# EAGLE design chainclock (EAGLE 7.4.0)
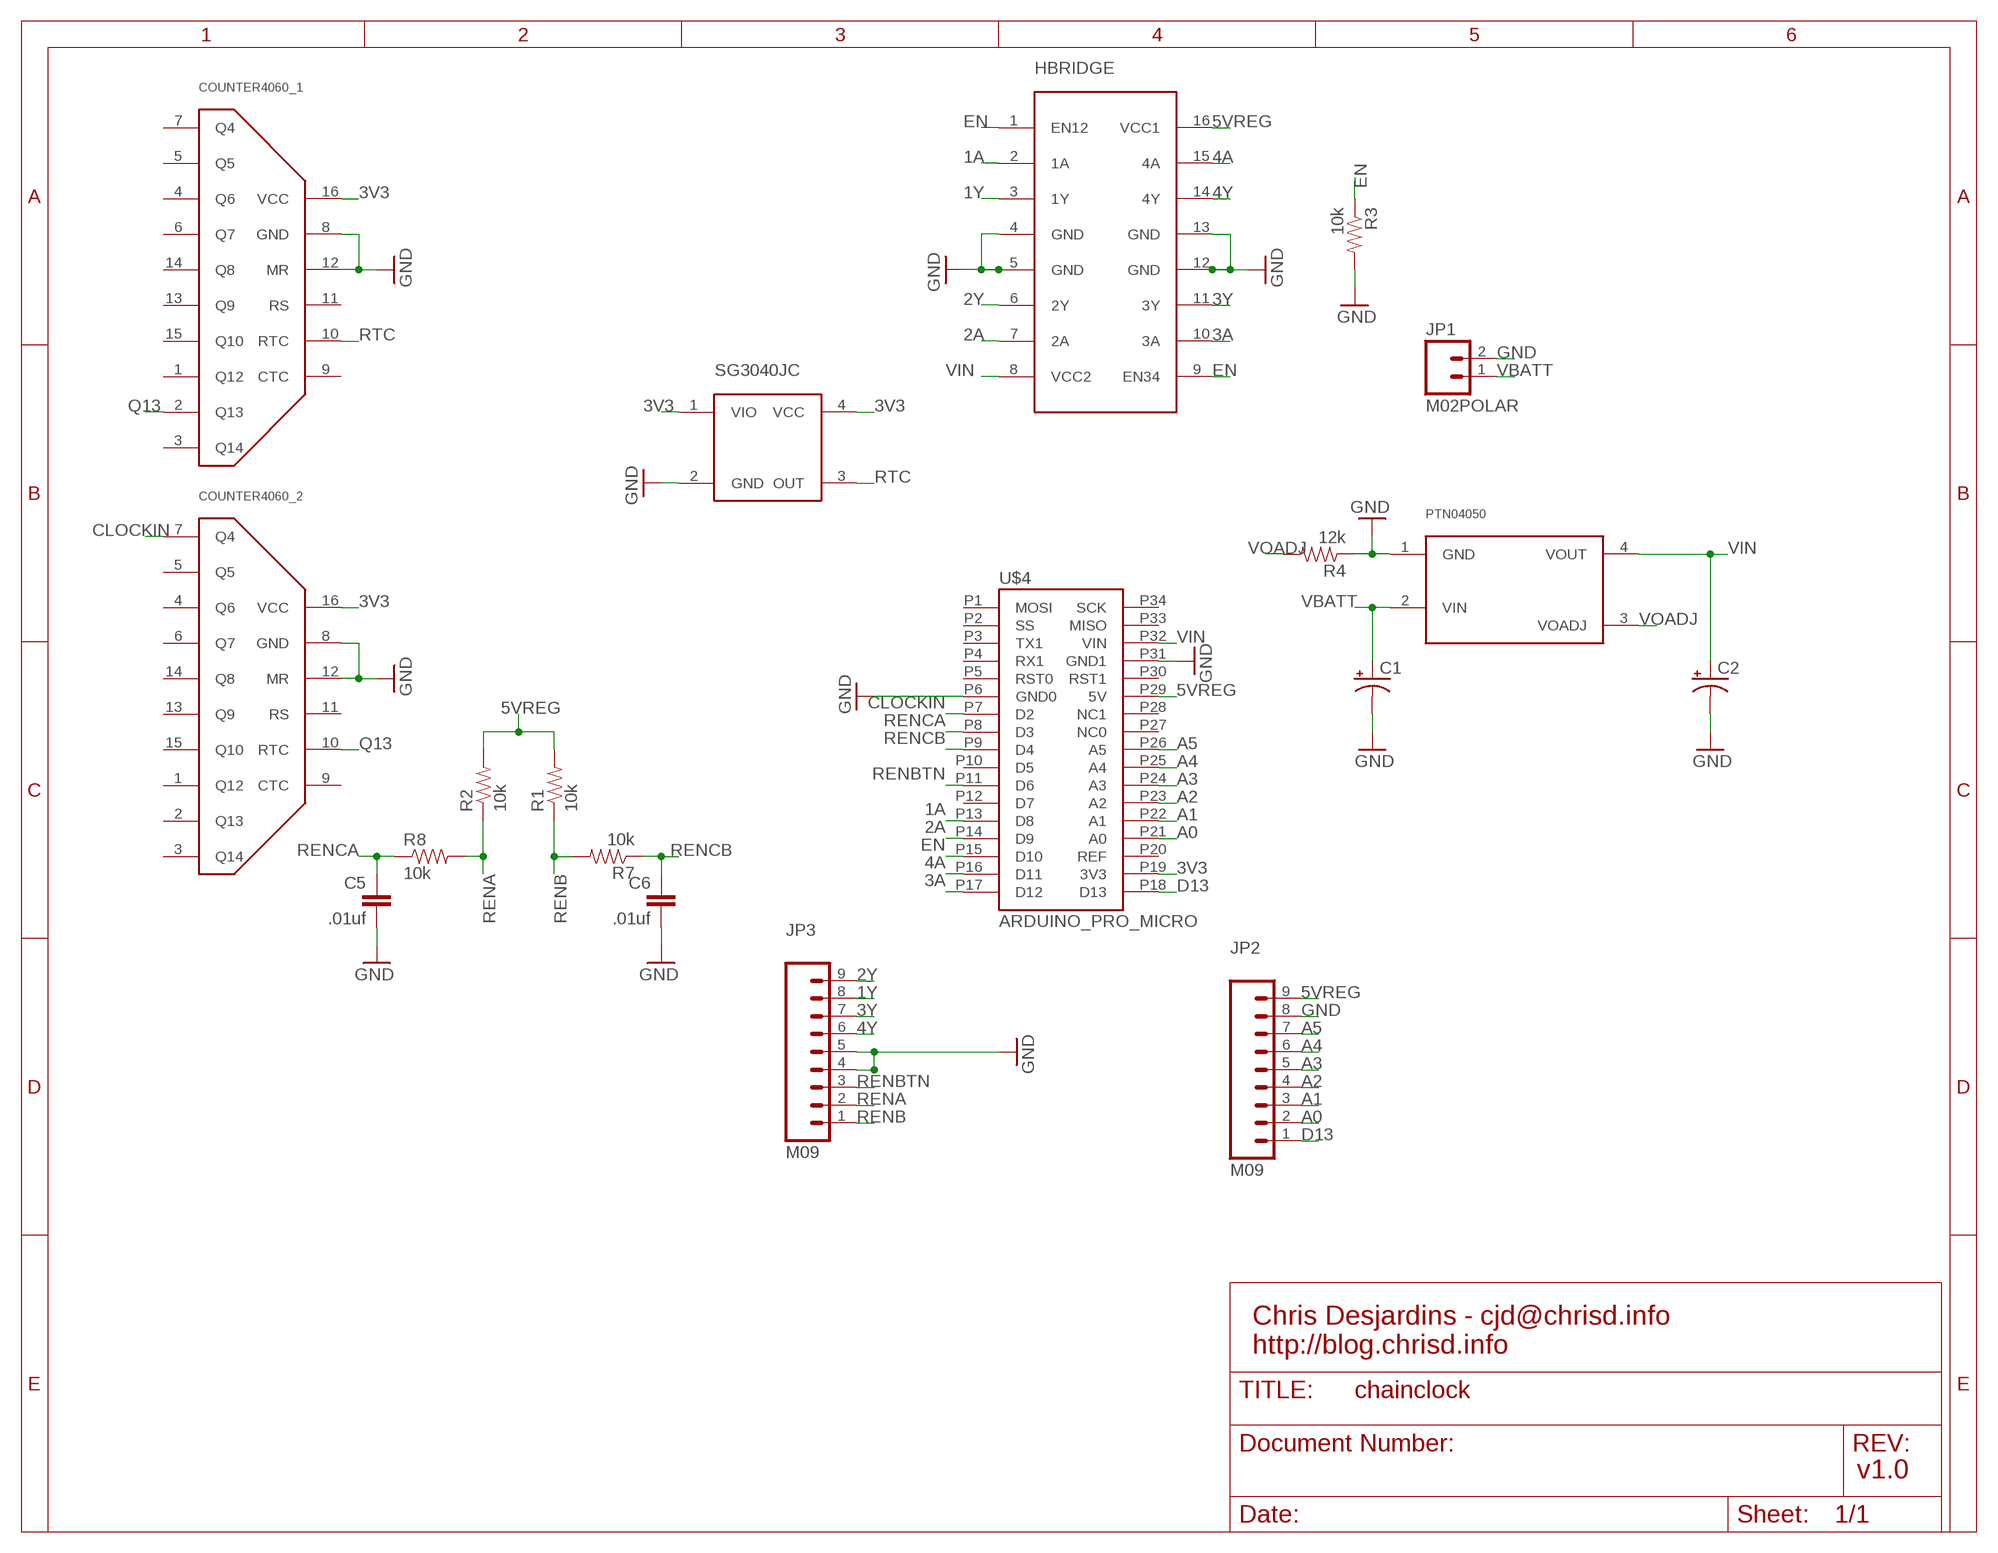
[diagram p0: schematic, sheet 1]

## Parts
C1  CAP_POLPTH1  [CPOL-RADIAL-100UF-25V]
C2  CAP_POLPTH1  [CPOL-RADIAL-100UF-25V]
C5  .01uf  CAPKIT  [CAP-PTH-SMALL-KIT]
C6  .01uf  CAPKIT  [CAP-PTH-SMALL-KIT]
COUNTER4060_1  4060SOIC16  [SO016]
COUNTER4060_2  4060SOIC16  [SO016]
HBRIDGE  SN754410  [DIL16-KIT]
JP1  M02POLAR  [MOLEX-1X2]
JP2  M09  [1X09]
JP3  M09  [1X09]
PTN04050  PTN0405C  [EUU4]
R1  10k  RESISTOREZ  [AXIAL-0.3EZ]
R2  10k  RESISTOREZ  [AXIAL-0.3EZ]
R3  10k  RESISTOREZ  [AXIAL-0.3EZ]
R4  12k  RESISTOREZ  [AXIAL-0.3EZ]
R7  10k  RESISTOREZ  [AXIAL-0.3EZ]
R8  10k  RESISTOREZ  [AXIAL-0.3EZ]
SG3040JC  SG30XXJC  [SG3030JC]
U$4  ARDUINO_PRO_MICRO  [ARDUINO_PRO_MICRO]

## Nets
1A: HBRIDGE.2(1A) U$4.P13(D8)
1Y: HBRIDGE.3(1Y) JP3.8
2A: HBRIDGE.7(2A) U$4.P14(D9)
2Y: HBRIDGE.6(2Y) JP3.9
3A: HBRIDGE.10(3A) U$4.P17(D12)
3V3: COUNTER4060_1.16(VCC) COUNTER4060_2.16(VCC) SG3040JC.1(VIO) SG3040JC.4(VCC) U$4.P19(3V3)
3Y: HBRIDGE.11(3Y) JP3.7
4A: HBRIDGE.15(4A) U$4.P16(D11)
4Y: HBRIDGE.14(4Y) JP3.6
5VREG: HBRIDGE.16(VCC1) JP2.9 R1.P$2 R2.P$2 U$4.P29(5V)
A0: JP2.2 U$4.P21(A0)
A1: JP2.3 U$4.P22(A1)
A2: JP2.4 U$4.P23(A2)
A3: JP2.5 U$4.P24(A3)
A4: JP2.6 U$4.P25(A4)
A5: JP2.7 U$4.P26(A5)
CLOCKIN: COUNTER4060_2.7(Q4) U$4.P7(D2)
D13: JP2.1 U$4.P18(D13)
EN: HBRIDGE.1(EN12) HBRIDGE.9(EN34) R3.P$1 U$4.P15(D10)
GND: C1.2(-) C2.2(-) C5.2 C6.2 COUNTER4060_1.8(GND) COUNTER4060_1.12(MR) COUNTER4060_2.8(GND) COUNTER4060_2.12(MR) HBRIDGE.4(GND) HBRIDGE.5(GND) HBRIDGE.12(GND) HBRIDGE.13(GND) JP1.2 JP2.8 JP3.4 JP3.5 PTN04050.1(GND) R3.P$2 R4.P$1 SG3040JC.2(GND) U$4.P6(GND0) U$4.P31(GND1)
Q13: COUNTER4060_1.2(Q13) COUNTER4060_2.10(RTC)
RENA: JP3.2 R2.P$1 R8.P$2
RENB: JP3.1 R1.P$1 R7.P$2
RENBTN: JP3.3 U$4.P11(D6)
RENCA: C5.1 R8.P$1 U$4.P8(D3)
RENCB: C6.1 R7.P$1 U$4.P9(D4)
RTC: COUNTER4060_1.10(RTC) SG3040JC.3(OUT)
VBATT: C1.1(+) JP1.1 PTN04050.2(VIN)
VIN: C2.1(+) HBRIDGE.8(VCC2) PTN04050.4(VOUT) U$4.P32(VIN)
VOADJ: PTN04050.3(VOADJ) R4.P$2
Unconnected: COUNTER4060_1.1(Q12) COUNTER4060_1.3(Q14) COUNTER4060_1.4(Q6) COUNTER4060_1.5(Q5) COUNTER4060_1.6(Q7) COUNTER4060_1.7(Q4) COUNTER4060_1.9(CTC) COUNTER4060_1.11(RS) COUNTER4060_1.13(Q9) COUNTER4060_1.14(Q8) COUNTER4060_1.15(Q10) COUNTER4060_2.1(Q12) COUNTER4060_2.2(Q13) COUNTER4060_2.3(Q14) COUNTER4060_2.4(Q6) COUNTER4060_2.5(Q5) COUNTER4060_2.6(Q7) COUNTER4060_2.9(CTC) COUNTER4060_2.11(RS) COUNTER4060_2.13(Q9) COUNTER4060_2.14(Q8) COUNTER4060_2.15(Q10) U$4.P1(MOSI) U$4.P2(SS) U$4.P3(TX1) U$4.P4(RX1) U$4.P5(RST0) U$4.P10(D5) U$4.P12(D7) U$4.P27(NC0) U$4.P28(NC1) U$4.P30(RST1) U$4.P33(MISO) U$4.P34(SCK)

## Notes on the sheet
- Chris Desjardins - cjd@chrisd.info
  http://blog.chrisd.info
- v1.0

## Power pins joined to a net without a drawn wire
REF: U$4.P20(REF)

## Library data of the parts
C1 C2 = SparkFun-Capacitors:CAP_POL: Capacitor Polarized These are standard SMD and PTH capacitors. Normally 10uF, 47uF, and 100uF in electrolytic and tantalum varieties. Always verify the external diameter of the through hole cap, it varies with capacity, voltage, and manufacturer. The EIA devices should be standard.
C5 C6 = SparkFun-Capacitors:CAP: Capacitor Standard 0603 ceramic capacitor, and 0.1" leaded capacitor.
COUNTER4060_1 COUNTER4060_2 = desjardins:4060
HBRIDGE = desjardins:SN754410
JP1 = desjardins:M02: Standard 2-pin 0.1" header. Use with - straight break away headers ( PRT-00116) - right angle break away headers (PRT-00553) - swiss pins (PRT-00743) - machine pins (PRT-00117) - female headers (PRT-00115) Molex polarized connector foot print use with: PRT-08233 with associated crimp pins and housings. 2.54_SCREWTERM for use with PRT-10571. 3.5mm Screw Terminal footprints for PRT-08084 5mm Screw Terminal footprints for use with PRT-08433
JP2 JP3 = SparkFun-Connectors:M09: Header 9 Standard 9-pin 0.1" header. Use with straight break away headers (SKU : PRT-00116), right angle break away headers (PRT-00553), swiss pins (PRT-00743), machine pins (PRT-00117), and female headers (PRT-00115).
PTN04050 = desjardins:PTN0405C
R1-R4 R7 R8 = SparkFun-Resistors:RESISTOR: Resistor Basic schematic elements and footprints for 0603, 1206, and PTH resistors.
SG3040JC = desjardins:SG30XX
U$4 = ChrisD:ARDUINO_PRO_MICRO

## Board
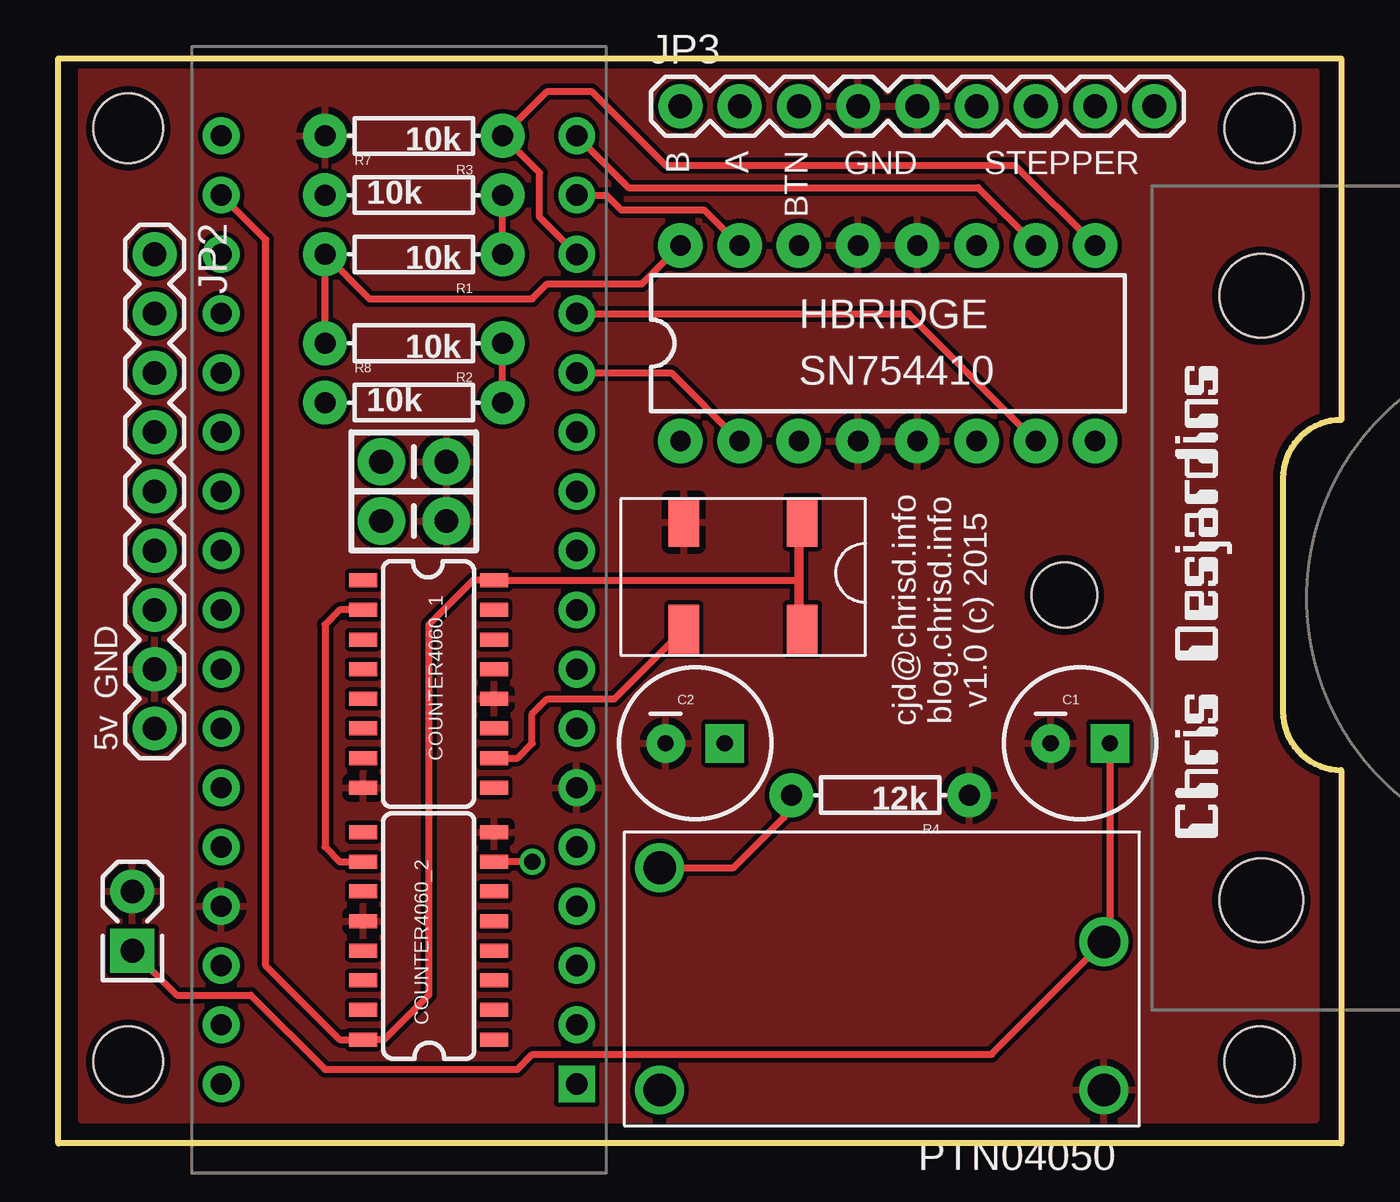
[diagram p1: board, top side]
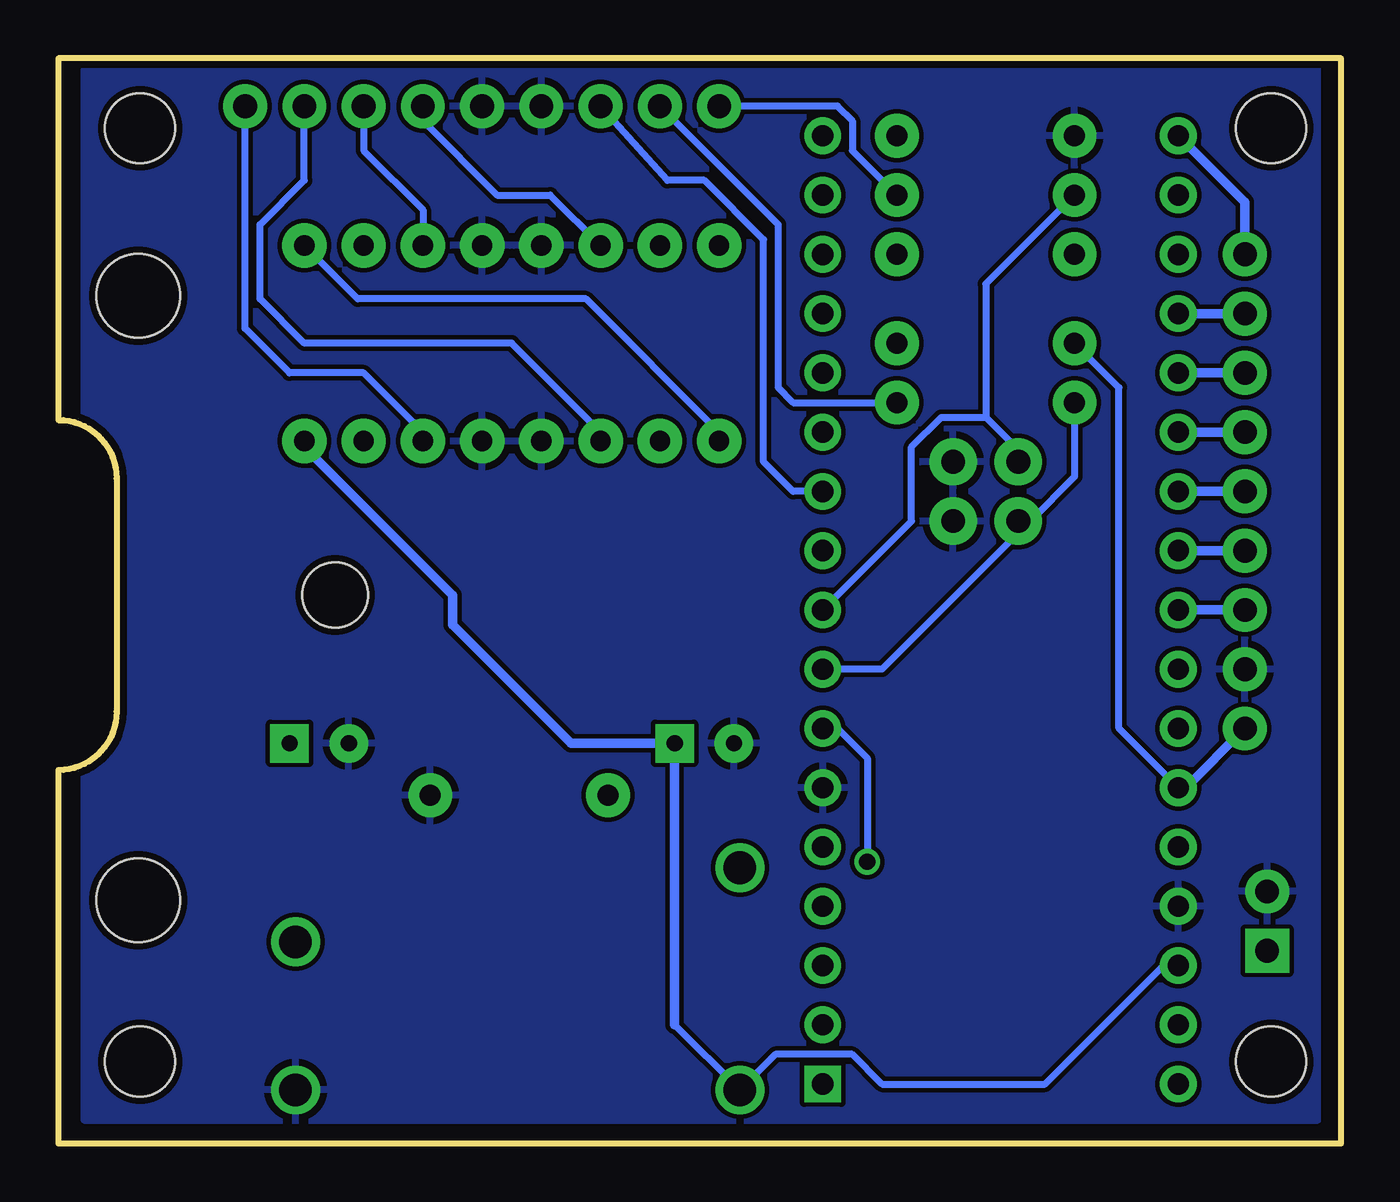
[diagram p2: board, bottom side, seen from below]

Size 55 x 46.5 mm. Coordinates in mm from the lower left corner, seen from the top.
Outline: 0,0 0,46.5 55,46.5 55,31 arc90 52.5,28.5 52.5,18.5 arc90 55,16 55,0 0,0
Copper layers (1*16): Top 0.035mm / dielectric 0.2mm / Bottom 0.035mm
Design rules "Eagle_WEdirekt_192_check *": minimum track width 0.192mm, minimum drill 0.2mm, track to track 0.192mm, track to pad 0.192mm, pad to pad 0.192mm, via to via 0.192mm, smd to smd 0.192mm, copper to edge 0.3mm, drill to drill 0.6mm, minimum pad ring 0.225mm, minimum via ring 0.2mm, stop-mask expansion 0.075mm, vias tented up to drill 0mil, thermal gap 0.3mm
Holes 3 mm at 3,3.5 3,43.5 51.5,3.5 51.5,43.5
Holes 2.8 mm at 43.13,23.5

### Footprints (pad centres in the part's own frame; a part is rotated, then mirrored left to right if it is on the bottom)
CPOL-RADIAL-100UF-25V = drill 0.7 pad 1.651 square: 1 1.27,0 | drill 0.7 pad 1.651: 2 -1.27,0
CAP-PTH-SMALL-KIT = drill 1.016 pad 2.032: 1 -1.397,0; 2 1.397,0
SO016 = smd 0.6 x 1.2: 1 -4.445,-2.8; 2 -3.175,-2.8; 3 -1.905,-2.8; 4 -0.635,-2.8; 5 0.635,-2.8; 6 1.905,-2.8; 7 3.175,-2.8; 8 4.445,-2.8; 9 4.445,2.8; 10 3.175,2.8; 11 1.905,2.8; 12 0.635,2.8; 13 -0.635,2.8; 14 -1.905,2.8; 15 -3.175,2.8; 16 -4.445,2.8
DIL16-KIT = drill 0.864 pad 1.905: 1 -8.89,-4.191; 2 -6.35,-4.191; 3 -3.81,-4.191; 4 -1.27,-4.191; 5 1.27,-4.191; 6 3.81,-4.191; 7 6.35,-4.191; 8 8.89,-4.191; 9 8.89,4.191; 10 6.35,4.191; 11 3.81,4.191; 12 1.27,4.191; 13 -1.27,4.191; 14 -3.81,4.191; 15 -6.35,4.191; 16 -8.89,4.191
MOLEX-1X2 = drill 1.016 pad 1.88 square: 1 0,0 | drill 1.016 pad 1.88: 2 2.54,0
1X09 = drill 1.016 pad 1.88: 1 0,0; 2 2.54,0; 3 5.08,0; 4 7.62,0; 5 10.16,0; 6 12.7,0; 7 15.24,0; 8 17.78,0; 9 20.32,0
EUU4 = drill 1.397: 1 1.524,11.049; 2 1.524,4.699; 3 20.574,1.524; 4 20.574,11.049
AXIAL-0.3EZ = drill 0.9 pad 1.88: P$1 -3.81,0; P$2 3.81,0
SG3030JC = smd 1.3 x 2.1: 1 2.71,1; 2 7.79,1; 3 7.79,5.6; 4 2.71,5.6
NEMA14 = hole 3.6: -13.081,12.827; 12.827,12.827
ARDUINO_PRO_MICRO = drill 0.914 pad 1.575 square: P1 1.27,44.45 | drill 0.914 pad 1.575: P2 1.27,41.91; P3 1.27,39.37; P4 1.27,36.83; P5 1.27,34.29; P6 1.27,31.75; P7 1.27,29.21; P8 1.27,26.67; P9 1.27,24.13; P10 1.27,21.59; P11 1.27,19.05; P12 1.27,16.51; P13 1.27,13.97; P14 1.27,11.43; P15 1.27,8.89; P16 1.27,6.35; P17 1.27,3.81; P18 16.51,3.81; P19 16.51,6.35; P20 16.51,8.89; P21 16.51,11.43; P22 16.51,13.97; P23 16.51,16.51; P24 16.51,19.05; P25 16.51,21.59; P26 16.51,24.13; P27 16.51,26.67; P28 16.51,29.21; P29 16.51,31.75; P30 16.51,34.29; P31 16.51,36.83; P32 16.51,39.37; P33 16.51,41.91; P34 16.51,44.45

### Placement (x,y rotation side)
C1  43.81,17.14 0 top
C2  27.3,17.14 0 top
C5  15.24,26.67 0 top
C6  15.24,29.21 0 top
COUNTER4060_1  15.88,19.68 270 top
COUNTER4060_2  15.88,8.89 90 top
HBRIDGE  35.56,34.29 0 top
JP1  3.17,8.26 90 top
JP2  4.13,38.1 270 top
JP3  26.67,44.45 0 top
PTN04050  46.35,13.34 180 top
R1  15.24,38.1 180 top
R2  15.24,34.29 180 top
R3  15.24,43.18 180 top
R4  35.24,14.92 180 top
R7  15.24,40.64 0 top
R8  15.24,31.75 0 top
SG3040JC  34.61,27.62 180 top
U$2  [NEMA14]  64.41,23.5 90 top
U$3  [LOGO]  49.71,13.01 90 top
U$4  23.5,46.99 180 top

### Tracks (layer width: path | path; a pad name or v marks a point on that pad's centre or on a via)
1A
  Top 0.305: U$4.P13 26.29,33.02 HBRIDGE.2
1Y
  Bottom 0.305: HBRIDGE.3 31.75,30.48 35.56,34.29 44.45,34.29 46.35,36.2 46.35,39.37 44.45,41.27 JP3.8
2A
  Top 0.305: U$4.P14 36.45,35.56 HBRIDGE.7
2Y
  Bottom 0.305: HBRIDGE.6 39.37,30.48 41.91,33.02 45.09,33.02 46.99,34.92 JP3.9
3A
  Top 0.305: U$4.P17 24.45,40.96 39.43,40.96 HBRIDGE.10
3V3
  Top 0.305: U$4.P19 8.89,38.73 8.89,7.62 12.06,4.45 COUNTER4060_2.16 13.97,4.45 15.88,6.35 15.88,22.23 17.78,24.13 COUNTER4060_1.16 31.75,24.13
  Top 0.406: SG3040JC.1 31.75,26.48 31.75,24.13 31.75,22.17 SG3040JC.4
3Y
  Bottom 0.305: JP3.7 41.91,42.55 39.37,40.01 HBRIDGE.11
4A
  Top 0.305: U$4.P16 23.5,40.64 24.13,40.01 27.69,40.01 HBRIDGE.15
4Y
  Bottom 0.305: JP3.6 39.37,43.81 36.2,40.64 33.91,40.64 HBRIDGE.14
5VREG
  Top 0.305: R2.P$2 R1.P$2 13.34,36.2 20.32,36.2 20.95,36.83 25.02,36.83 HBRIDGE.16
  Bottom 0.305: U$4.P29 9.53,17.78 9.53,32.38 R2.P$2
  Bottom 0.406: U$4.P29 6.67,15.24 JP2.9
A0
  Bottom 0.406: U$4.P21 JP2.2
A1
  Bottom 0.406: U$4.P22 JP2.3
A2
  Bottom 0.406: U$4.P23 JP2.4
A3
  Bottom 0.406: U$4.P24 JP2.5
A4
  Bottom 0.406: U$4.P25 JP2.6
A5
  Bottom 0.406: U$4.P26 JP2.7
CLOCKIN  (via drill 0.7)
  Top 0.305: v20.32,12.06 COUNTER4060_2.7
  Bottom 0.305: U$4.P7 21.59,17.78 20.32,16.51 v20.32,12.06
D13
  Bottom 0.406: U$4.P18 4.13,40.32 JP2.1
EN
  Top 0.305: HBRIDGE.9 41.02,41.91 26.04,41.91 22.86,45.09 20.95,45.09 R3.P$1 20.64,41.59 20.64,39.69 U$4.P15
  Bottom 0.305: HBRIDGE.1 26.67,30.48 32.38,36.2 42.16,36.2 HBRIDGE.9
GND
  pour Top: 1,1 1,46 53.91,46 53.91,1
  pour Bottom: 1,1 1,46 53.91,46 53.91,1
Q13
  Top 0.305: COUNTER4060_1.2 12.06,22.86 11.43,22.23 11.43,12.7 12.06,12.06 COUNTER4060_2.10
RENA
  Top 0.305: R8.P$2 R2.P$1
  Bottom 0.305: R8.P$2 23.5,31.75 24.13,32.38 24.13,39.37 JP3.2
RENB
  Top 0.305: R1.P$1 R7.P$2
  Bottom 0.305: R7.P$2 20.95,42.55 20.95,43.81 21.59,44.45 JP3.1
RENBTN
  Bottom 0.305: U$4.P11 23.5,27.94 24.77,29.21 24.77,38.73 27.3,41.27 28.89,41.27 JP3.3
RENCA
  Bottom 0.305: R8.P$1 11.43,28.57 13.34,26.67 C5.1 13.84,26.16 19.68,20.32 U$4.P8
RENCB
  Bottom 0.305: U$4.P9 18.41,26.67 18.41,29.84 17.14,31.11 15.24,31.11 | 15.24,31.11 13.97,29.84 13.97,29.34 C6.1 | 15.24,31.11 15.24,36.83 R7.P$1
RTC
  Top 0.305: COUNTER4060_1.10 19.68,16.51 20.32,17.14 20.32,18.41 20.95,19.05 23.84,19.05 SG3040JC.3
VBATT
  Top 0.305: JP1.1 5.08,6.35 8.26,6.35 11.43,3.17 19.68,3.17 20.32,3.81 40.01,3.81 PTN04050.2 45.09,8.89 C1.1
VIN
  Bottom 0.305: U$4.P32 7.62,7.62 12.7,2.54 19.68,2.54 20.95,3.81 24.26,3.81 PTN04050.4 28.57,5.08 | HBRIDGE.8 44.45,29.84
  Bottom 0.406: 44.45,29.84 38.1,23.5 38.1,22.23 33.02,17.14 C2.1 28.57,5.08
VOADJ
  Top 0.305: PTN04050.3 28.96,11.81 31.11,13.97 31.11,14.61 R4.P$2

### Text on the board
tPlace: B | A | BTN | GND | STEPPER | cjd@chrisd.info / blog.chrisd.info / v1.0 (c) 2015 | GND | 5v